# EAGLE design TSOC-USBUART1 (EAGLE 6.6.0)
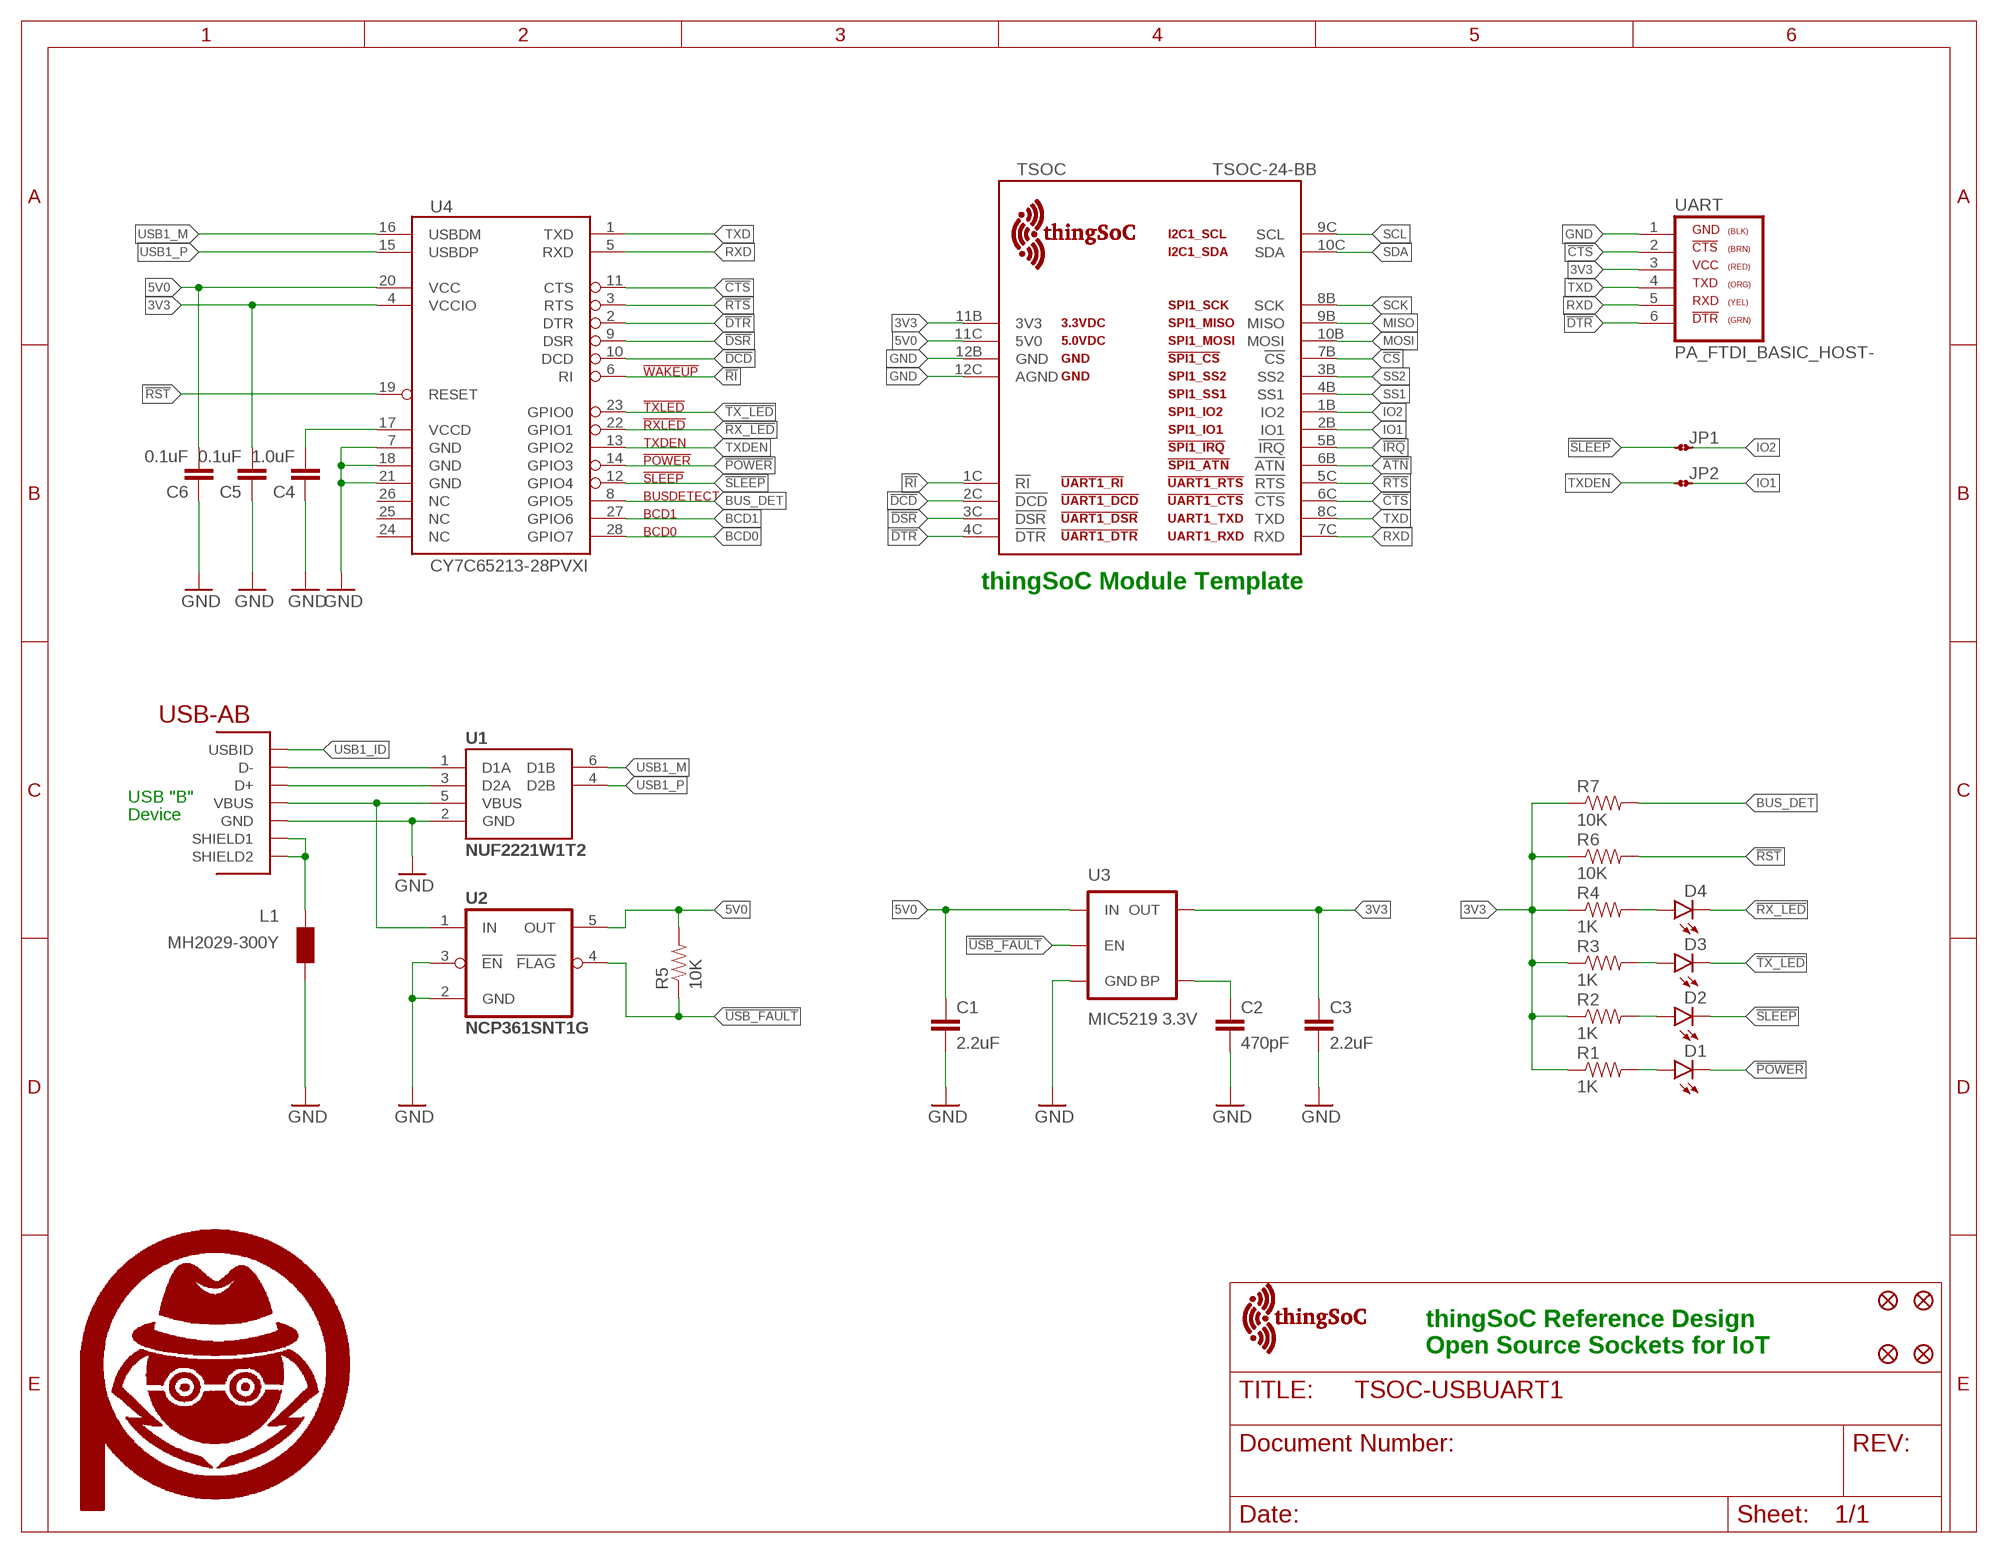
[diagram p0: schematic, sheet 1]

## Parts
C1  2.2uF  CAP0603-CAP  [0603-CAP]
C2  470pF  CAP0603-CAP  [0603-CAP]
C3  2.2uF  CAP0603-CAP  [0603-CAP]
C4  1.0uF  CAP0603-CAP  [0603-CAP]
C5  0.1uF  CAP0603-CAP  [0603-CAP]
C6  0.1uF  CAP0603-CAP  [0603-CAP]
D1  LED0603  [LED-0603]
D2  LED0603  [LED-0603]
D3  LED0603  [LED-0603]
D4  LED0603  [LED-0603]
FID1  FIDUCIAL1.5X3  [FIDUCIAL-1.5X3]
FID2  FIDUCIAL1.5X3  [FIDUCIAL-1.5X3]
FID3  FIDUCIAL1.5X3  [FIDUCIAL-1.5X3]
FID4  FIDUCIAL1.5X3  [FIDUCIAL-1.5X3]
JP1  JMP-2-NO  [JMP-2-NO]
JP2  JMP-2-NO  [JMP-2-NO]
L1  MH2029-300Y  WE-CBF_0805  [0805]
R1  1K  RESISTOR0603-RES  [0603-RES]
R2  1K  RESISTOR0603-RES  [0603-RES]
R3  1K  RESISTOR0603-RES  [0603-RES]
R4  1K  RESISTOR0603-RES  [0603-RES]
R5  10K  RESISTOR0603-RES  [0603-RES]
R6  10K  RESISTOR0603-RES  [0603-RES]
R7  10K  RESISTOR0603-RES  [0603-RES]
TSOC  TSOC-24-BB  [TSOC-BB-S24]
U1  NUF2221W1T2  [SOT-363]
U2  NCP361SNT1G  [SOP95P275X110-5N]
U3  MIC5219 3.3V  V_REG_MIC52193.3V  [SOT23-5]
U4  CY7C65213-28PVXI  [SSOP28DB]
U$1  PA_LOGO_SYMMED  [PA_LOGO_AGENT_MED_SYM]
U$2  PA_LOGO_SYMMED  [PA_LOGO_AGENT_MED_SYM]
U$3  TSOC-LOGO-SMALL  [TSOC-LOGO-SML]
U$4  TSOC-LOGO-SMALL  [TSOC-LOGO-SML]
UART  PA_FTDI_BASIC_HOST-  [PA_FTDI_M5X1]
USB1  USB_AB  [USB-AB-MICRO-SMD]

## Nets
3V3: C3.1 C5.2 R1.1 R2.1 R3.1 R4.1 R6.1 R7.1 TSOC.11B(3V3) U3.5(OUT) U4.4(VCCIO) UART.3
5V0: C1.1 C6.2 R5.2 TSOC.11C(5V0) U2.5(OUT) U3.1(IN) U4.20(VCC)
!ATN: TSOC.6B(!ATN)
!CS: TSOC.7B(!CS)
!CTS: TSOC.6C(!CTS) U4.11(CTS) UART.2
!DCD: TSOC.2C(!DCD) U4.10(DCD)
!DSR: TSOC.3C(!DSR) U4.9(DSR)
!DTR: TSOC.4C(!DTR) U4.2(DTR) UART.6
!IRQ: TSOC.5B(!IRQ)
!POWER: D1.C U4.14(GPIO3)
!RI: TSOC.1C(!RI) U4.6(RI)
!RST: R6.2 U4.19(RESET)
!RTS: TSOC.5C(!RTS) U4.3(RTS)
!RX_LED: D4.C U4.22(GPIO1)
!SLEEP: D2.C JP1.1 U4.12(GPIO4)
!TX_LED: D3.C U4.23(GPIO0)
!USB_FAULT: R5.1 U2.4(!FLAG) U3.3(EN)
BCD0: U4.28(GPIO7)
BCD1: U4.27(GPIO6)
BLUE: D3.A R3.2
BUS_DET: R7.2 U4.8(GPIO5)
BYPASS: C2.1 U3.4(BP)
GND [vcc]: C1.2 C2.2 C3.2 C4.1 C5.1 C6.1 L1.2 TSOC.12B(GND) TSOC.12C(AGND) U1.2(GND) U2.2(GND) U2.3(!EN) U3.2(GND) U4.7(GND) U4.18(GND) U4.21(GND) UART.1 USB1.GND
GRN: D1.A R1.2
IO1: JP2.2 TSOC.2B(IO1)
IO2: JP1.2 TSOC.1B(IO2)
MISO: TSOC.9B(MISO)
MOSI: TSOC.10B(MOSI)
RED: D2.A R2.2
RXD: TSOC.7C(RXD) U4.5(RXD) UART.5
SCK: TSOC.8B(SCK)
SCL: TSOC.9C(SCL)
SDA: TSOC.10C(SDA)
SS1: TSOC.4B(SS1)
SS2: TSOC.3B(SS2)
TXD: TSOC.8C(TXD) U4.1(TXD) UART.4
TXDEN: JP2.1 U4.13(GPIO2)
USB1_DM: U1.1(D1A) USB1.D-
USB1_DP: U1.3(D2A) USB1.D+
USB1_ID: USB1.ID(USBID)
USB1_M: U1.6(D1B) U4.16(USBDM)
USB1_P: U1.4(D2B) U4.15(USBDP)
USB1_SHIELD: L1.1 USB1.SHIELD1 USB1.SHIELD2
USB1_VBUS: U1.5(VBUS) U2.1(IN) USB1.VBUS
VCCD: C4.2 U4.17(VCCD)
YEL: D4.A R4.2
Unconnected: U4.24(NC) U4.25(NC) U4.26(NC)

## Notes on the sheet
- thingSoC Module Template
- USB "B"
- Device
- thingSoC Reference Design
  Open Source Sockets for IoT

## Library data of the parts
C1-C6 = PatternAgents-ProtoPads:CAP: Capacitor Standard 0603 ceramic capacitor, and 0.1" leaded capacitor.
D1-D4 = SparkFun-LED:LED: LEDs Standard schematic elements and footprints for 5mm, 3mm, 1206, and 0603 sized LEDs. 5mm - Spark Fun Electronics SKU : COM-00529 (and others)
FID1-FID4 = PatternAgents-Misc:FIDUCIAL: Fiducial Alignment Points Various fiducial points for machine vision alignment.
JP1 JP2 = PatternAgents-ProtoPads:JMP-2-NO: Two Terminal Jumper - Normally Open Positions 1 and 2 are normally NOT connected. PatternAgents ProtoPads Library Schematic and PCB layout libraries for design patterns by PatternAgents. For the CADSoft Eagle CAD program : http://www.cadsoftusa.com/download-eagle/ Source LBR : http://www.patternagents.com Github : https://github.com/PatternAgents License : http://creativecommons.org/licenses/by-sa/4.0/ (Creative Commons 4.0) THIS SOFTWARE IS PROVIDED BY THE CONTRIBUTORS "AS IS" AND WITHOUT ANY EXPRESS OR IMPLIED WARRANTIES, INCLUDING, BUT NOT LIMITED TO, THE IMPLIED WARRANTIES OF MERCHANTABILITY AND FITNESS FOR A PARTICULAR PURPOSE ARE DISCLAIMED. IN NO EVENT SHALL THE COPYRIGHT OWNER OR CONTRIBUTORS BE LIABLE FOR ANY DIRECT, INDIRECT, INCIDENTAL, SPECIAL, EXEMPLARY, OR CONSEQUENTIAL DAMAGES (INCLUDING, BUT NOT LIMITED TO, PROCUREMENT OF SUBSTITUTE GOODS OR SERVICES; LOSS OF USE, DATA, OR PROFITS; OR BUSINESS INTERRUPTION) HOWEVER CAUSED AND ON ANY THEORY OF LIABILITY, WHETHER IN CONTRACT, STRICT LIABILITY, OR TORT (INCLUDING NEGLIGENCE OR OTHERWISE) ARISING IN ANY WAY OUT OF THE USE OF THIS SOFTWARE, EVEN IF ADVISED OF THE POSSIBILITY OF SUCH DAMAGE.; BOM: EXCLUDE
L1 = wuerth-elektronik:WE-CBF: SMD EMI Suppression Ferrite Beads - excellent anti-EMI properties - low DCR - impedances till 3000 ohms - rated current up to 6 A
R1-R7 = PatternAgents-ProtoPads:RESISTOR: Resistor Basic schematic elements and footprints for 0603, 1206, and PTH resistors.
TSOC = thingSoC:TSOC-24: thingSoC Twenty-Four(24) Pin Socket Source LBR : http://www.thingsoc.com Github : https://github.com/thingsoc License : http://creativecommons.org/licenses/by-sa/4.0/ (Creative Commons 4.0) THIS SOFTWARE IS PROVIDED BY THE CONTRIBUTORS "AS IS" AND WITHOUT ANY EXPRESS OR IMPLIED WARRANTIES, INCLUDING, BUT NOT LIMITED TO, THE IMPLIED WARRANTIES OF MERCHANTABILITY AND FITNESS FOR A PARTICULAR PURPOSE ARE DISCLAIMED. IN NO EVENT SHALL THE COPYRIGHT OWNER OR CONTRIBUTORS BE LIABLE FOR ANY DIRECT, INDIRECT, INCIDENTAL, SPECIAL, EXEMPLARY, OR CONSEQUENTIAL DAMAGES (INCLUDING, BUT NOT LIMITED TO, PROCUREMENT OF SUBSTITUTE GOODS OR SERVICES; LOSS OF USE, DATA, OR PROFITS; OR BUSINESS INTERRUPTION) HOWEVER CAUSED AND ON ANY THEORY OF LIABILITY, WHETHER IN CONTRACT, STRICT LIABILITY, OR TORT (INCLUDING NEGLIGENCE OR OTHERWISE) ARISING IN ANY WAY OUT OF THE USE OF THIS SOFTWARE, EVEN IF ADVISED OF THE POSSIBILITY OF SUCH DAMAGE.
U1 = PatternAgents-OnSemi:NUF2221W1T2: NUF2221W1T2 USB ESD Protection, EMI FIlter, and Line Termination
U2 = PatternAgents-OnSemi:NCP361SNT1G: USB Positive Overvoltage Protection Controller; MPN: NCP361SNT1G; OC_FARNELL: 1642242; OC_NEWARK: 01P0135; PACKAGE: TSOP-5; SUPPLIER: ON Semiconductor
U3 = SparkFun-PowerIC:V_REG_MIC5219: V_REG MIC5219 Standard 3.3V and 5V 500mA LDO voltage regulator in SOT-23 layout. Micrel part MIC5219. BP (by-pass) pin is used to lower output noise with 470pF cap, may be left open.; PROD_ID: VREG-09872
U4 = PatternAgents-Cypress:CY7C65213-28: Cypress EZ-USB ® CY7C65213-28SSOP USB TO UART BRIDGE Full-Speed USB Peripheral Controller Source Data: http://www.cypress.com/?mpn=CY7C65213-28xxxx LBR Source: http://www.patternagents.com THIS SOFTWARE IS PROVIDED BY THE CONTRIBUTORS "AS IS" AND WITHOUT ANY EXPRESS OR IMPLIED WARRANTIES, INCLUDING, BUT NOT LIMITED TO, THE IMPLIED WARRANTIES OF MERCHANTABILITY AND FITNESS FOR A PARTICULAR PURPOSE ARE DISCLAIMED. IN NO EVENT SHALL THE COPYRIGHT OWNER OR CONTRIBUTORS BE LIABLE FOR ANY DIRECT, INDIRECT, INCIDENTAL, SPECIAL, EXEMPLARY, OR CONSEQUENTIAL DAMAGES (INCLUDING, BUT NOT LIMITED TO, PROCUREMENT OF SUBSTITUTE GOODS OR SERVICES; LOSS OF USE, DATA, OR PROFITS; OR BUSINESS INTERRUPTION) HOWEVER CAUSED AND ON ANY THEORY OF LIABILITY, WHETHER IN CONTRACT, STRICT LIABILITY, OR TORT (INCLUDING NEGLIGENCE OR OTHERWISE) ARISING IN ANY WAY OUT OF THE USE OF THIS SOFTWARE, EVEN IF ADVISED OF THE POSSIBILITY OF SUCH DAMAGE.
U$1 U$2 = PatternAgents-Logos:PA_LOGO_SYM: PatternAgents Logo Symbol Trademark : PatternAgents, LLC Github : https://github.com/PatternAgents/PCB_Libraries License : http://creativecommons.org/licenses/by-sa/3.0/ (Creative Commons 3.0) THIS SOFTWARE IS PROVIDED BY THE CONTRIBUTORS "AS IS" AND WITHOUT ANY EXPRESS OR IMPLIED WARRANTIES, INCLUDING, BUT NOT LIMITED TO, THE IMPLIED WARRANTIES OF MERCHANTABILITY AND FITNESS FOR A PARTICULAR PURPOSE ARE DISCLAIMED. IN NO EVENT SHALL THE COPYRIGHT OWNER OR CONTRIBUTORS BE LIABLE FOR ANY DIRECT, INDIRECT, INCIDENTAL, SPECIAL, EXEMPLARY, OR CONSEQUENTIAL DAMAGES (INCLUDING, BUT NOT LIMITED TO, PROCUREMENT OF SUBSTITUTE GOODS OR SERVICES; LOSS OF USE, DATA, OR PROFITS; OR BUSINESS INTERRUPTION) HOWEVER CAUSED AND ON ANY THEORY OF LIABILITY, WHETHER IN CONTRACT, STRICT LIABILITY, OR TORT (INCLUDING NEGLIGENCE OR OTHERWISE) ARISING IN ANY WAY OUT OF THE USE OF THIS SOFTWARE, EVEN IF ADVISED OF THE POSSIBILITY OF SUCH DAMAGE.
U$3 U$4 = thingSoC:TSOC-LOGO: thingSoC Logo Source LBR : http://www.thingsoc.com Github : https://github.com/thingsoc License : http://creativecommons.org/licenses/by-sa/4.0/ (Creative Commons 4.0) THIS SOFTWARE IS PROVIDED BY THE CONTRIBUTORS "AS IS" AND WITHOUT ANY EXPRESS OR IMPLIED WARRANTIES, INCLUDING, BUT NOT LIMITED TO, THE IMPLIED WARRANTIES OF MERCHANTABILITY AND FITNESS FOR A PARTICULAR PURPOSE ARE DISCLAIMED. IN NO EVENT SHALL THE COPYRIGHT OWNER OR CONTRIBUTORS BE LIABLE FOR ANY DIRECT, INDIRECT, INCIDENTAL, SPECIAL, EXEMPLARY, OR CONSEQUENTIAL DAMAGES (INCLUDING, BUT NOT LIMITED TO, PROCUREMENT OF SUBSTITUTE GOODS OR SERVICES; LOSS OF USE, DATA, OR PROFITS; OR BUSINESS INTERRUPTION) HOWEVER CAUSED AND ON ANY THEORY OF LIABILITY, WHETHER IN CONTRACT, STRICT LIABILITY, OR TORT (INCLUDING NEGLIGENCE OR OTHERWISE) ARISING IN ANY WAY OUT OF THE USE OF THIS SOFTWARE, EVEN IF ADVISED OF THE POSSIBILITY OF SUCH DAMAGE.
UART = PatternAgents-Interface:PA_FTDI_BASIC_HOST: PatternAgents FTDI UART BASIC Pattern Pinout for "BASIC" FTDI USB-UART adaptor from Sparkfun and others. Source LBR : http://www.patternagents.com Github : https://github.com/patternagents Source Data : http://www.sparkfun.com/datasheets/DevTools/Arduino/FTDI%20Basic-v21-5V.pdf PA Pattern License : http://creativecommons.org/licenses/by-sa/4.0/ (Creative Commons 4.0) THIS SOFTWARE IS PROVIDED BY THE CONTRIBUTORS "AS IS" AND WITHOUT ANY EXPRESS OR IMPLIED WARRANTIES, INCLUDING, BUT NOT LIMITED TO, THE IMPLIED WARRANTIES OF MERCHANTABILITY AND FITNESS FOR A PARTICULAR PURPOSE ARE DISCLAIMED. IN NO EVENT SHALL THE COPYRIGHT OWNER OR CONTRIBUTORS BE LIABLE FOR ANY DIRECT, INDIRECT, INCIDENTAL, SPECIAL, EXEMPLARY, OR CONSEQUENTIAL DAMAGES (INCLUDING, BUT NOT LIMITED TO, PROCUREMENT OF SUBSTITUTE GOODS OR SERVICES; LOSS OF USE, DATA, OR PROFITS; OR BUSINESS INTERRUPTION) HOWEVER CAUSED AND ON ANY THEORY OF LIABILITY, WHETHER IN CONTRACT, STRICT LIABILITY, OR TORT (INCLUDING NEGLIGENCE OR OTHERWISE) ARISING IN ANY WAY OUT OF THE USE OF THIS SOFTWARE, EVEN IF ADVISED OF THE POSSIBILITY OF SUCH DAMAGE.
USB1 = BeeSafe:USB_AB: This is a USB AB connector that is compatible with USB OTG. i.e. this connector can serve as a host or device

## Net classes
1 vcc: width 0.254 mm

## Board
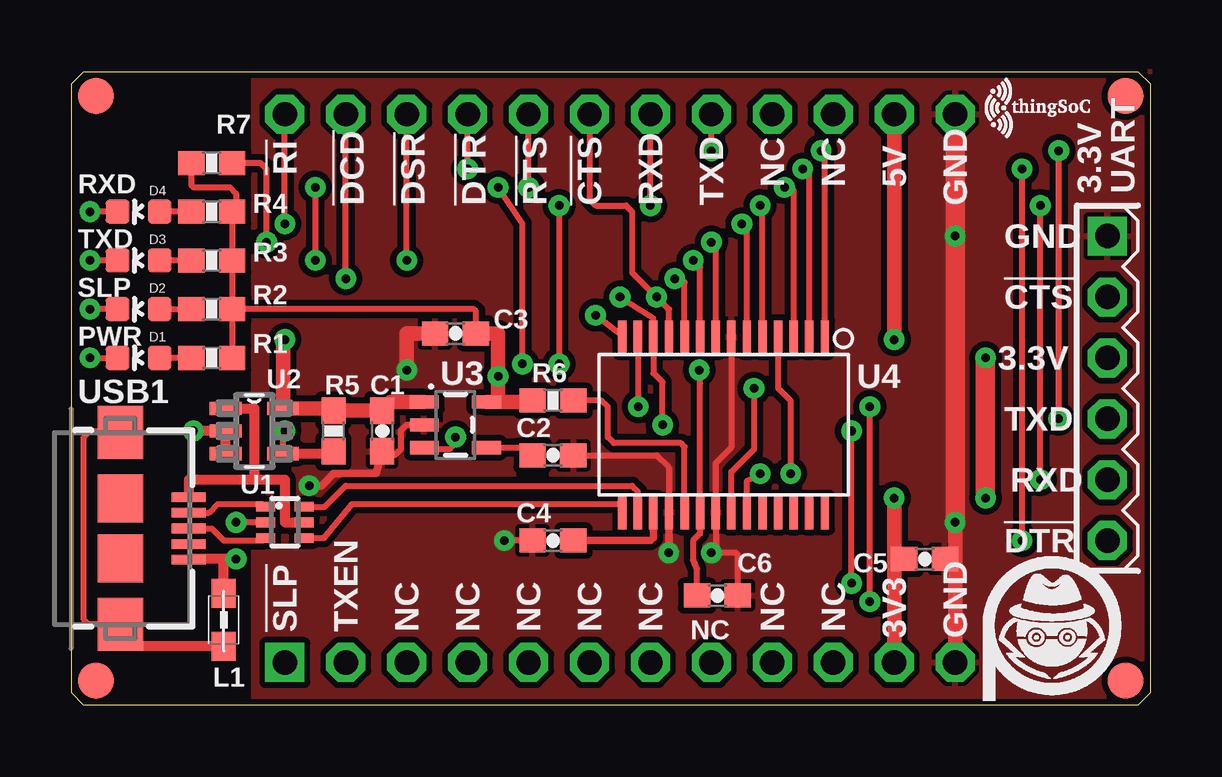
[diagram p1: board, top side]
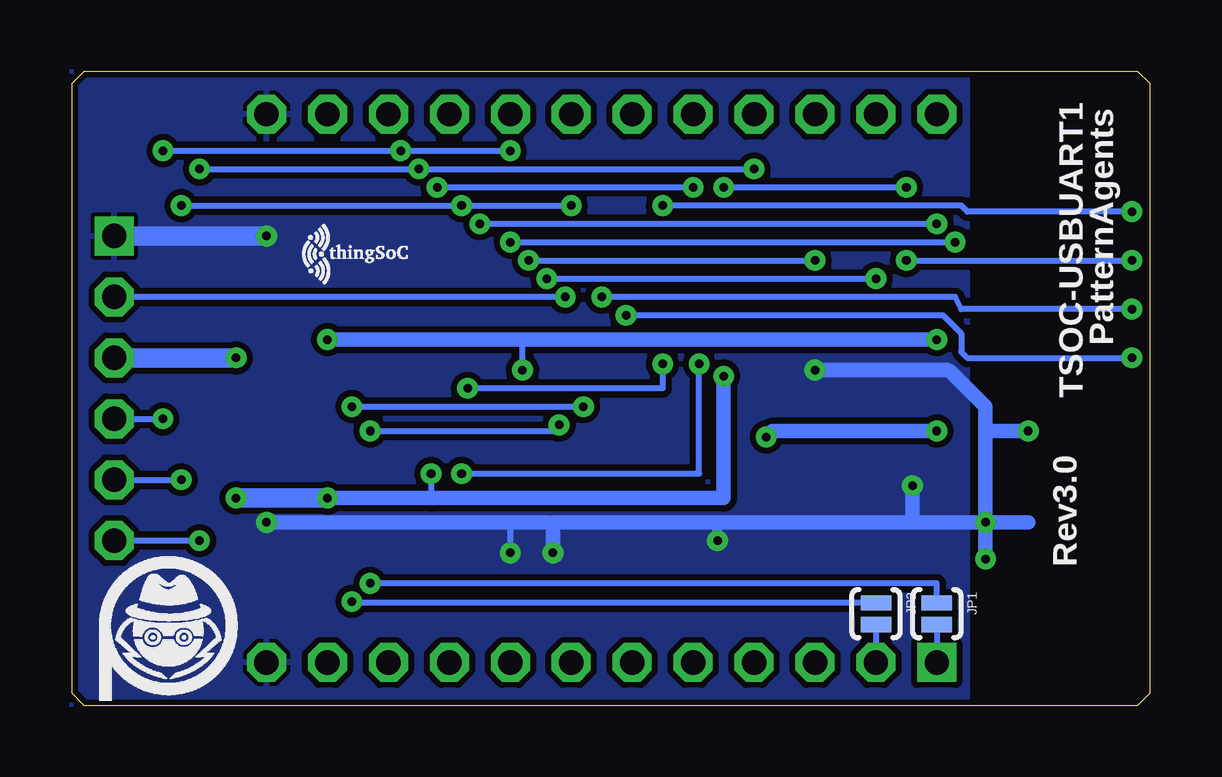
[diagram p2: board, bottom side, seen from below]

Size 44.96 x 26.42 mm. Coordinates in mm from the lower left corner, seen from the top.
Outline: 0.51,0 0,0.51 0,25.91 0.51,26.42 44.45,26.42 44.96,25.91 44.96,0.51 44.45,0 0.51,0
Copper layers (1*16): Top 0.035mm / dielectric 1.5mm / Bottom 0.035mm
Design rules "PatternAgents_7mil": minimum track width 7mil, minimum drill 14mil, track to track 7mil, track to pad 7mil, pad to pad 7mil, via to via 7mil, smd to smd 7mil, copper to edge 7mil, drill to drill 7mil, minimum pad ring 12mil, minimum via ring 10mil, stop-mask expansion 4mil, vias tented up to drill 25mil, thermal gap 7mil

### Footprints (pad centres in the part's own frame; a part is rotated, then mirrored left to right if it is on the bottom)
0603-CAP = smd 1.1 x 1: 1 -0.85,0; 2 0.85,0
LED-0603 = smd 1 x 1: A 0,-0.877; C 0,0.877
FIDUCIAL-1.5X3 = smd 1.5 x 1.5: 1 0,0
JMP-2-NO = smd 0.635 x 1.27: 1 -0.45,0; 2 0.45,0
0805 = smd 1.2 x 1: 1 -1.1,0; 2 1.1,0
0603-RES = smd 1.1 x 1: 1 -0.85,0; 2 0.85,0
TSOC-BB-S24 = drill 1.016 square: 1B -11.43,-11.43 | drill 1.016 octagon: 1C -11.43,11.43; 2B -8.89,-11.43; 2C -8.89,11.43; 3B -6.35,-11.43; 3C -6.35,11.43; 4B -3.81,-11.43; 4C -3.81,11.43; 5B -1.27,-11.43; 5C -1.27,11.43; 6B 1.27,-11.43; 6C 1.27,11.43; 7B 3.81,-11.43; 7C 3.81,11.43; 8B 6.35,-11.43; 8C 6.35,11.43; 9B 8.89,-11.43; 9C 8.89,11.43; 10B 11.43,-11.43; 10C 11.43,11.43; 11B 13.97,-11.43; 11C 13.97,11.43; 12B 16.51,-11.43; 12C 16.51,11.43
SOT-363 = smd 0.4 x 0.8: 1 -0.65,-0.8; 2 0,-0.8; 3 0.65,-0.8; 4 0.65,0.8; 5 0,0.8; 6 -0.65,0.8
SOP95P275X110-5N = smd 1.321 x 0.559: 1 -1.194,0.94; 2 -1.194,0; 3 -1.194,-0.94; 4 1.194,-0.94; 5 1.194,0.94
SOT23-5 = smd 0.55 x 1.2: 1 -0.95,-1.3; 2 0,-1.3; 3 0.95,-1.3; 4 0.95,1.3; 5 -0.95,1.3
SSOP28DB = smd 0.348 x 1.397: 1 -4.225,-3.656; 2 -3.575,-3.656; 3 -2.925,-3.656; 4 -2.275,-3.656; 5 -1.625,-3.656; 6 -0.975,-3.656; 7 -0.325,-3.656; 8 0.325,-3.656; 9 0.975,-3.656; 10 1.625,-3.656; 11 2.275,-3.656; 12 2.925,-3.656; 13 3.575,-3.656; 14 4.225,-3.656; 15 4.225,3.656; 16 3.575,3.656; 17 2.925,3.656; 18 2.275,3.656; 19 1.625,3.656; 20 0.975,3.656; 21 0.325,3.656; 22 -0.325,3.656; 23 -0.975,3.656; 24 -1.625,3.656; 25 -2.275,3.656; 26 -2.925,3.656; 27 -3.575,3.656; 28 -4.225,3.656
PA_FTDI_M5X1 = drill 1.016 square: 1 -1.27,6.35 | drill 1.016 octagon: 2 -1.27,3.81; 3 -1.27,1.27; 4 -1.27,-1.27; 5 -1.27,-3.81; 6 -1.27,-6.35
USB-AB-MICRO-SMD = smd 1.4 x 0.4: D+ 2.85,0; D- 2.85,0.65; GND 2.85,-1.3; ID 2.85,-0.65; VBUS 2.85,1.3 | smd 1.9 x 2: P$6 0,1.25; P$7 0,-1.25 | smd 1.9 x 2.2: SHIELD1 0,4; SHIELD2 0,-4

### Placement (x,y rotation side)
C1  12.95,11.43 270 top
C2  20.07,10.41 0 top
C3  16,15.49 180 top
C4  20.07,6.86 0 top
C5  35.56,6.1 180 top
C6  26.92,4.57 180 top
D1  2.79,14.48 90 top
D2  2.79,16.51 90 top
D3  2.79,18.54 90 top
D4  2.79,20.57 90 top
FID1  1.02,1.02 0 top
FID2  43.94,1.02 0 top
FID3  1.02,25.4 0 top
FID4  43.94,25.4 0 top
JP1  8.89,3.81 270 bottom
JP2  11.43,3.81 270 bottom
L1  6.35,3.56 90 top
R1  5.84,14.48 180 top
R2  5.84,16.51 180 top
R3  5.84,18.54 180 top
R4  5.84,20.57 180 top
R5  10.92,11.43 90 top
R6  20.07,12.7 0 top
R7  5.84,22.61 0 top
TSOC  20.32,13.21 0 top
U1  8.89,7.62 270 top
U2  7.62,11.43 0 top
U3  16,11.68 270 top
U4  27.18,11.68 180 top
U$1  40.89,2.79 0 top
U$2  40.89,2.79 0 bottom
U$3  34.54,18.8 0 bottom
U$4  38.86,24.89 0 top
UART  44.45,13.21 0 top
USB1  2.03,7.37 0 top

### Tracks (layer width: path | path; a pad name or v marks a point on that pad's centre or on a via)
3V3  (via drill 0.36)
  Top 0.254: 29.96,9.66 v29.97,9.65 29.97,12.7 29.45,13.22 U4.4 | R7.1 4.99,21.68 5.08,21.59 6.6,21.59 6.86,21.34 6.86,20.74 R4.1 R3.1 R2.1 | R2.1 R1.1 | C3.1 16.85,16.42 16.76,16.51 R2.1
  Top 0.61: R6.1 19.15,12.63 U3.5 17.71,12.63 17.78,12.7 v17.78,13.72 17.78,15.49 C3.1 | TSOC.11B 34.29,6.18 | 34.29,6.18 C5.2 | v34.29,8.64 34.29,6.18
  Top 0.813: v38.1,8.64 v38.1,14.48
  Bottom 0.254: v29.97,9.65 29.97,8.64
  Bottom 0.61: v17.78,13.72 17.78,8.64 29.97,8.64 v34.29,8.64
  Bottom 0.813: v34.29,8.64 v38.1,8.64 | v38.1,14.48 UART.3
5V0  (via drill 0.36)
  Top 0.254: v26.16,13.97 26.2,13.42 U4.20 26.2,7.15 25.91,6.86 25.91,6.1 26.07,5.68 C6.2
  Top 0.61: U3.1 13.31,12.63 C1.1 R5.2 10.83,12.37 U2.5 8.81,15.16 v8.89,15.24 | TSOC.11C v34.29,15.24
  Bottom 0.254: v26.16,13.97 26.16,14.99 25.91,15.24
  Bottom 0.61: v34.29,15.24 25.91,15.24 v8.89,15.24
!CTS  (via drill 0.36)
  Top 0.254: TSOC.6C 21.59,21.08 21.84,20.83 23.11,20.83 23.37,20.57 23.37,18.03 v24.38,17.02 24.9,16.5 U4.11
  Bottom 0.254: v24.38,17.02 UART.2
!DCD  (via drill 0.36)
  Top 0.254: U4.10 25.55,17.63 v25.15,17.78 | v11.43,17.78 TSOC.2C
  Bottom 0.254: v25.15,17.78 v11.43,17.78
!DSR  (via drill 0.36)
  Top 0.254: U4.9 26.2,18.25 v25.91,18.54 | v13.97,18.54 TSOC.3C
  Bottom 0.254: v25.91,18.54 v13.97,18.54
!DTR  (via drill 0.36)
  Top 0.254: U4.2 30.75,22.08 v30.48,22.35 | v16.51,22.35 TSOC.4C | v39.62,6.86 v39.62,22.35
  Bottom 0.254: v16.51,22.35 v30.48,22.35 v39.62,22.35 | UART.6 v39.62,6.86
!POWER  (via drill 0.36)
  Top 0.254: U4.14 22.95,15.4 v21.84,16.26 | v0.76,14.48 D1.C
  Bottom 0.254: v21.84,16.26 8.64,16.26 7.87,15.49 7.87,14.73 7.62,14.48 v0.76,14.48
!RI  (via drill 0.36)
  Top 0.254: U4.6 28.15,19.85 v27.94,20.07 | v8.89,20.07 TSOC.1C
  Bottom 0.254: v27.94,20.07 v8.89,20.07
!RST
  Top 0.254: U4.19 25.55,10.77 25.4,10.92 22.61,10.92 22.35,11.18 22.35,12.45 22.1,12.7 R6.2
!RTS  (via drill 0.36)
  Top 0.254: U4.3 30.1,21.46 v29.72,21.59 | v19.05,21.59 TSOC.5C
  Bottom 0.254: v29.72,21.59 v19.05,21.59
!RX_LED  (via drill 0.36)
  Top 0.254: D4.C v0.76,20.57 | v20.32,20.83 v20.32,14.22 | v28.45,13.21 28.45,10.67 27.5,9.72 U4.22
  Bottom 0.254: v0.76,20.57 7.62,20.57 7.87,20.83 v20.32,20.83 | v20.32,14.22 20.32,13.21 v28.45,13.21
!SLEEP  (via drill 0.36)
  Top 0.254: D2.C v0.76,16.51 | v22.86,17.02 24.25,16.13 U4.12 24.25,13.85 24.64,13.46 v24.64,11.68 | v32.51,5.08 v32.51,11.43
  Bottom 0.254: v0.76,16.51 7.87,16.51 8.13,17.02 v22.86,17.02 | JP1.1 8.89,5.08 v32.51,5.08 | v32.51,11.43 24.89,11.43 v24.64,11.68
!TX_LED  (via drill 0.36)
  Top 0.254: D3.C v0.76,18.54 | U4.23 28.15,9.36 v28.7,9.65 | v18.8,14.22 18.8,20.07 v17.78,21.59 | v10.16,21.59 v10.16,18.54
  Bottom 0.254: v28.7,9.65 18.8,9.65 v18.8,14.22 | v17.78,21.59 v10.16,21.59 | v10.16,18.54 v0.76,18.54
!USB_FAULT  (via drill 0.36)
  Top 0.254: U2.4 8.81,11.35 v8.89,11.43 | v16,11.18 16,10.92 15.75,10.67 14.77,10.67 U3.3
  Top 0.406: U2.4 10.67,10.49 R5.1
  Bottom 0.254: 15.75,11.43 v16,11.18
  Bottom 0.61: v8.89,11.43 15.75,11.43
BLUE
  Top 0.254: R3.2 D3.A
BUS_DET  (via drill 0.36)
  Top 0.254: U4.8 26.85,19.12 v26.67,19.3 | v8.13,19.3 8.13,22.35 7.87,22.61 R7.2
  Bottom 0.254: v26.67,19.3 v8.13,19.3
BYPASS
  Top 0.254: U3.4 18.9,10.73 C2.1
GND  (via drill 0.36)
  Top 0.254: U1.2 v6.86,7.62 | 4.88,6.1 USB1.GND | C4.1 v18.03,6.86 | U3.2 13.97,11.68 13.72,11.43 13.72,10.67 13.46,10.41 13.12,10.41 C1.2 | C2.2 24.38,10.41 24.89,9.91 U4.18 | U4.7 27.5,10.74 26.85,10.09 U4.21 26.85,6.53 v26.67,6.35 27.69,6.35 27.77,6.26 C6.1
  Top 0.305: U4.18 24.9,6.36 v24.89,6.35 | v9.91,9.14 10.41,9.14 10.92,9.65 12.7,9.65 C1.2
  Top 0.406: v6.86,6.1 6.35,6.1 | 6.35,6.1 4.88,6.1 | L1.2 6.35,6.1 | v5.08,11.43 U2.2 U2.3
  Top 0.61: TSOC.12B 36.83,6.1 | 36.83,6.1 v36.83,7.62 | C5.1 36.83,6.1 | C3.2 13.97,15.49 v13.97,13.97
  Top 0.813: TSOC.12C v36.83,19.56 v36.83,7.62
  Bottom 0.254: v26.67,6.35 26.67,7.37 26.42,7.62
  Bottom 0.406: v18.03,6.86 18.03,7.62
  Bottom 0.61: v6.86,7.62 v6.86,6.1 | v9.91,9.14 9.91,7.62 | 5.08,7.62 v6.86,7.62 | 9.91,7.62 18.03,7.62 24.89,7.62 v24.89,6.35 | v6.86,7.62 9.91,7.62 | v36.83,7.62 26.42,7.62 25.16,7.62 | v5.08,11.43 6.6,11.43 arc-90 6.86,11.18 | 6.86,11.18 v6.86,7.62 | v13.97,13.97 8.49,13.97 arc45 8.31,13.9 6.86,12.45 6.86,11.18
  Bottom 0.813: UART.1 v36.83,19.56
  pour Top (isolate 0.254, hatched): 7.62,0 7.62,26.42 44.96,26.42 44.96,0
  pour Bottom (isolate 0.254, hatched): 7.62,0 7.62,26.42 44.96,26.42 44.96,0
GRN
  Top 0.254: R1.2 D1.A
IO1
  Bottom 0.254: JP2.2 TSOC.2B
IO2
  Bottom 0.254: JP1.2 TSOC.1B
RED
  Top 0.254: D2.A R2.2
RXD  (via drill 0.36)
  Top 0.254: U4.5 28.8,20.73 v28.7,20.83 | v24.13,20.83 TSOC.7C | v40.39,9.4 v40.39,20.83
  Bottom 0.254: v24.13,20.83 v28.7,20.83 v40.39,20.83 | UART.5 v40.39,9.4
TXD  (via drill 0.36)
  Top 0.254: U4.1 31.4,22.95 v31.24,23.11 | v26.67,23.11 TSOC.8C | v41.15,11.94 v41.15,23.11
  Bottom 0.254: v26.67,23.11 v31.24,23.11 v41.15,23.11 | UART.4 v41.15,11.94
TXDEN  (via drill 0.36)
  Top 0.254: v33.27,4.32 v33.27,12.45 | v23.62,12.45 23.62,15.32 U4.13
  Bottom 0.254: JP2.1 33.22,4.26 v33.27,4.32 | v33.27,12.45 v23.62,12.45
USB1_DM
  Top 0.254: USB1.D- 5.73,8.02 6.1,8.38 7.98,8.38 U1.1
USB1_DP
  Top 0.254: USB1.D+ 5.84,7.37 6.35,6.86 7.98,6.86 U1.3
USB1_M
  Top 0.254: U1.6 10.56,8.27 11.43,9.14 23.37,9.14 23.6,8.91 U4.16
USB1_P
  Top 0.254: U1.4 10.53,6.97 11.68,8.38 22.85,8.38 U4.15
USB1_SHIELD
  Top 0.254: USB1.SHIELD2 1.52,3.37 0.7,3.37 0.51,3.56 0.51,11.18 0.76,11.43 1.97,11.43 USB1.SHIELD1
  Top 0.406: 1.84,3.05 1.52,3.37 | L1.1 2.03,2.46 USB1.SHIELD2
USB1_VBUS
  Top 0.406: U1.5 8.89,7.62 8.89,9.4 7.62,9.4 | 7.62,9.4 4.88,9.4 USB1.VBUS | U2.1 7.62,12.37 7.62,9.4
VCCD
  Top 0.305: U4.17 24.25,6.98 24.13,6.86 C4.2
YEL
  Top 0.254: R4.2 D4.A

### Text on the board
tPlace: !RI | NC | NC | 5V | RXD | !DCD | !DSR | !DTR | !RTS | !CTS | RXD | TXD | GND | 3.3V | TXD | GND | SLP | !CTS | PWR | 3.3V | TXD | RXD | !DTR | NC | !SLP | TXEN | NC | NC | NC | NC | NC | NC | NC | 3V3 | GND
bPlace: PatternAgents | TSOC-USBUART1 | Rev3.0